# Altium project IRRI_adapter.PrjPcb
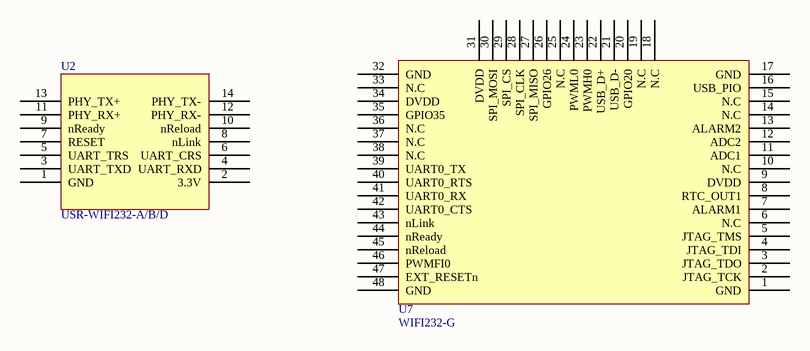
[diagram p0: Sheet1.SchDoc]
1 sheet, 2 parts. Net scope: global (net labels, ports and power ports of the same name join across sheets).
Board file: PCB1.PcbDoc

## Sheet Sheet1.SchDoc
size A; SheetNumber: 1; SheetTotal: 1

### Parts
U2  USR-WIFI232-A/B/D  [USR-WIFI232-A/B/D SMT 2X7]
U7  WIFI232-G  [USR-WIFI232-G]

### Nets

Not connected (* = marked no-connect by the designer): U2 1(GND) 2(3.3V) 3(UART_TXD) 4(UART_RXD) 5(UART_TRS) 6(UART_CRS) 7(RESET) 8(nLink) 9(nReady) 10(nReload) 11(PHY_RX+) 12(PHY_RX-) 13(PHY_TX+) 14(PHY_TX-); U7 1(GND) 2(JTAG_TCK) 3(JTAG_TDO) 4(JTAG_TDI) 5(JTAG_TMS) 6(N.C) 7(ALARM1) 8(RTC_OUT1) 9(DVDD) 10(N.C) 11(ADC1) 12(ADC2) 13(ALARM2) 14(N.C) 15(N.C) 16(USB_PIO) 17(GND) 18(N.C) 19(N.C) 20(GPIO20) 21(USB_D-) 22(USB_D+) 23(PWMH0) 24(PWML0) 25(N.C) 26(GPIO26) 27(SPI_MISO) 28(SPI_CLK) 29(SPI_CS) 30(SPI_MOSI) 31(DVDD) 32(GND) 33(N.C) 34(DVDD) 35(GPIO35) 36(N.C) 37(N.C) 38(N.C) 39(UART0_TX) 40(UART0_RTS) 41(UART0_RX) 42(UART0_CTS) 43(nLink) 44(nReady) 45(nReload) 46(PWMFI0) 47(EXT_RESETn) 48(GND)